# Altium schematic sheet POWER.SchDoc: Animated Archer Main PCB
size Letter; Author: John Eric Martin; Engineer: John Eric Martin; Organization: UCCS IEEE Robotics; Address1: 1420 Austin Bluffs Pkwy; Address2: Colorado Springs, CO 80918; DocumentNumber: POWER; Revision: 1; SheetNumber: 7; SheetTotal: 8; ProjectName: Animated Archer Quadcopter
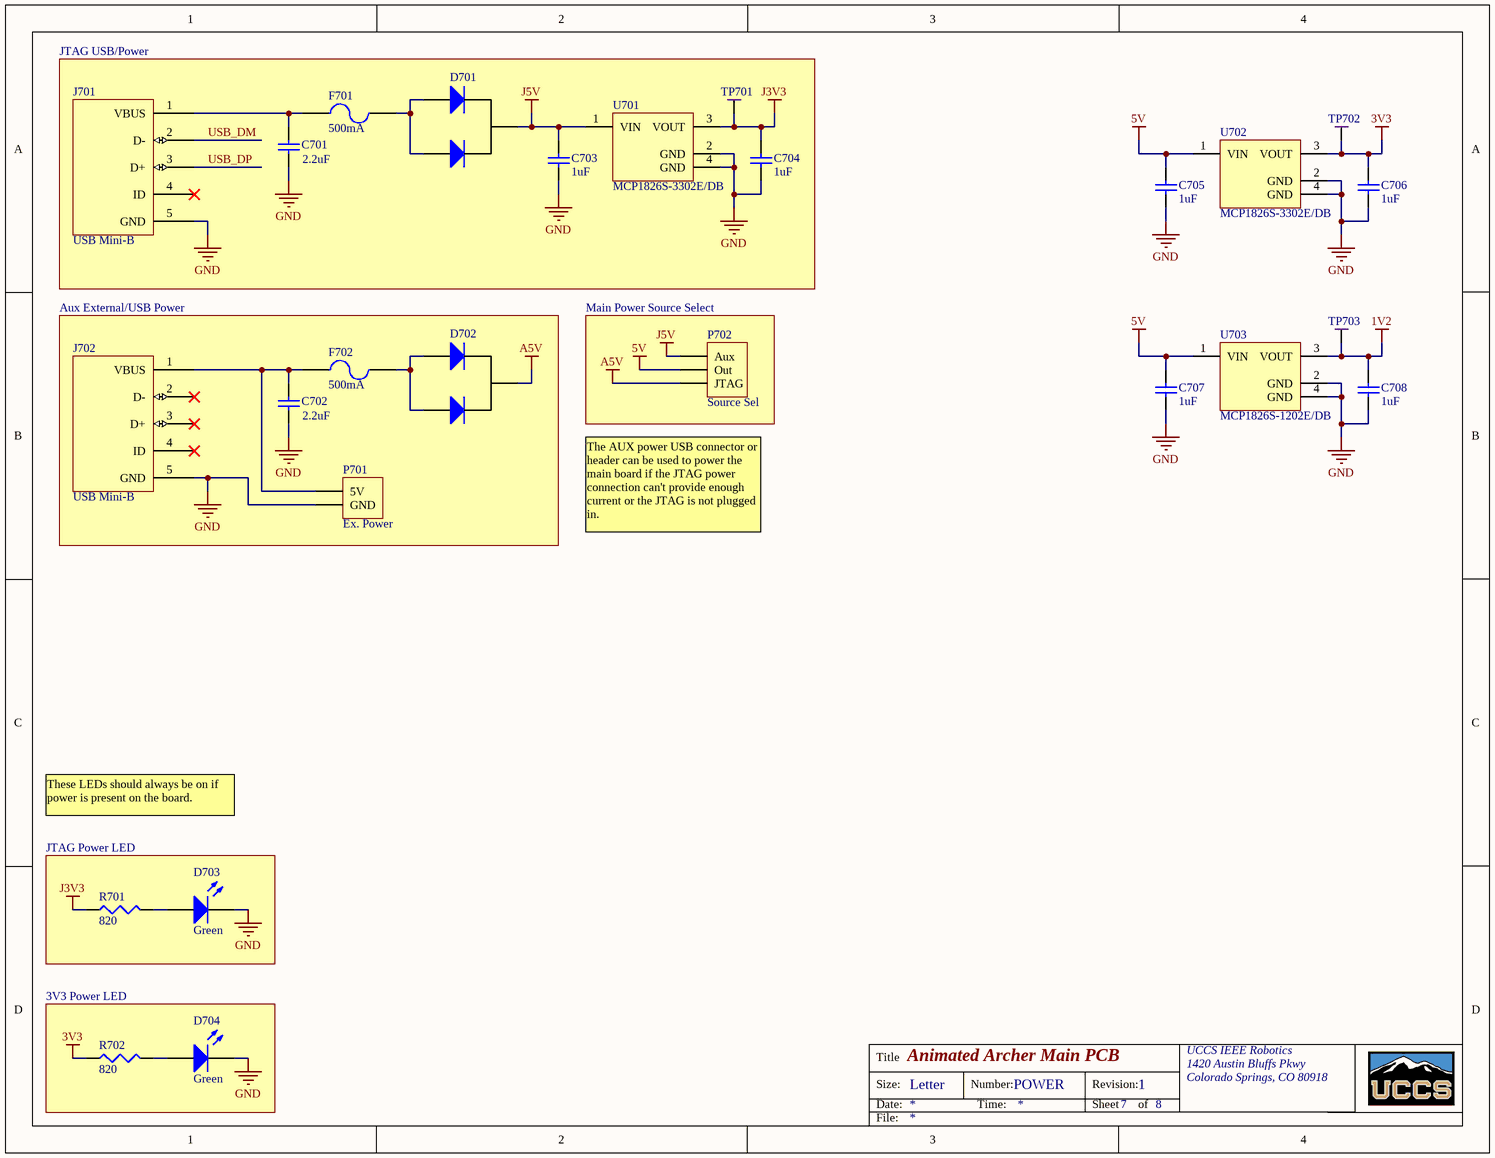
[diagram p0: POWER.SchDoc]

## Parts
C701  value 2.2uF  [1608[0603]]  (hidden comment: Cap Semi)
C702  value 2.2uF  [1608[0603]]  (hidden comment: Cap Semi)
C703  value 1uF  [1608[0603]]  (hidden comment: 0.1uF)
C704  value 1uF  [1608[0603]]  (hidden comment: 0.1uF)
C705  value 1uF  [1608[0603]]  (hidden comment: 0.1uF)
C706  value 1uF  [1608[0603]]  (hidden comment: 0.1uF)
C707  value 1uF  [1608[0603]]  (hidden comment: 0.1uF)
C708  value 1uF  [1608[0603]]  (hidden comment: 0.1uF)
D701  HSMS-2804-BLKG  [SOT-23_N]  (value not drawn)
D702  HSMS-2804-BLKG  [SOT-23_N]  (value not drawn)
D703  Green  [1608[0603]]
D704  Green  [1608[0603]]
F701  500mA  [C0805]
F702  500mA  [C0805]
J701  USB Mini-B  [54819-0572]
J702  USB Mini-B  [54819-0572]
P701  Ex. Power  [HDR1X2]
P702  Source Sel  [HDR1X3]
R701  value 820  [J1-0603]  (hidden comment: Res3)
R702  value 820  [J1-0603]  (hidden comment: Res3)
TP701  Test Point  [TESTPT]  (value not drawn)
TP702  Test Point  [TESTPT]  (value not drawn)
TP703  Test Point  [TESTPT]  (value not drawn)
U701  MCP1826S-3302E/DB  [SOT-223-DB3_N]
U702  MCP1826S-3302E/DB  [SOT-223-DB3_N]
U703  MCP1826S-1202E/DB  [SOT-223-DB3_N]

## Blocks framed on the sheet
JTAG USB/Power: C701 C703 C704 D701 F701 J701 TP701 U701
Aux External/USB Power: C702 D702 F702 J702 P701
Main Power Source Select: P702
JTAG Power LED: D703 R701
3V3 Power LED: D704 R702

## Nets
1V2: C708.2 TP703.1 U703.3(VOUT)
3V3: C706.2 R702.1 TP702.1 U702.3(VOUT)
5V: C705.2 C707.2 P702.2(Out) U702.1(VIN) U703.1(VIN)
A5V: D702.3(K) P702.3(JTAG)
GND: C701.2 C702.2 C703.1 C704.1 C705.1 C706.1 C707.1 C708.1 D703.2(K) D704.2(K) J701.5(GND) J702.5(GND) P701.2(GND) U701.2(GND) U701.4(GND) U702.2(GND) U702.4(GND) U703.2(GND) U703.4(GND)
J3V3: C704.2 R701.1 TP701.1 U701.3(VOUT)
J5V: C703.2 D701.3(K) P702.1(Aux) U701.1(VIN)
USB_DM: J701.2(D-)
USB_DP: J701.3(D+)
NetC701_1: C701.1 F701.2 J701.1(VBUS)
NetC702_1: C702.1 F702.2 J702.1(VBUS) P701.1(5V)
NetD701_1: D701.1(A) D701.2(B) F701.1
NetD702_1: D702.1(A) D702.2(B) F702.1
NetD703_1: D703.1(A) R701.2
NetD704_1: D704.1(A) R702.2

Not connected (* = marked no-connect by the designer): J701 4(ID)* 6(CASE); J702 2(D-)* 3(D+)* 4(ID)* 6(CASE)

## Notes on the sheet
- The AUX power USB connector or header can be used to power the main board if the JTAG power connection can't provide enough current or the JTAG is not plugged in.
- These LEDs should always be on if power is present on the board.
- Title
- Size:
- Date:
- Letter
- Number:
- Time:
- Revision:
- Sheet
- of
- File:

## Library data of the parts
C701-C708 = Cap Semi: Capacitor (Semiconductor SIM Model); Published: 8-Jun-2000; LatestRevisionDate: 29-May-2009; LatestRevisionNote: IPC-7351 Footprint Added.; PackageReference: C1206; Publisher: Altium Limited; PackageDescription: Chip Capacitor
D701 D702 = HSMS-2804-BLKG: Dual Common Cathode Schottky Diode; Note: Pin 2 is not connected and not drawn.; Published: 21-Mar-2003; LatestRevisionDate: 29-May-2009; LatestRevisionNote: IPC-7351 Footprint Added.; DatasheetVersion: Oct-1999; PackageVersion: Sep-2001; PackageReference: SOT-23; Publisher: Altium Limited; PackageDescription: 3-Pin SOT-23 Package 0.95 mm Pitch, 2.5 mm Lead Span; ComponentLink1Description: Manufacturer Link; ComponentLink1URL: http://www.infineon.com/
D703 D704 = LED2: Typical RED, GREEN, YELLOW, AMBER GaAs LED; Published: 8-Jun-2000; LatestRevisionDate: 17-Jul-2002; LatestRevisionNote: Re-released for DXP Platform.; PackageVersion: Feb-2002; PackageReference: 3.2X1.6X1.1; Publisher: Altium Limited; PackageDescription: SM LED; 2 Flat Leads
F701 F702 = Fuse 2: PTC Resettable Fuse; Published: 8-Jun-2000; LatestRevisionDate: 17-Jul-2002; LatestRevisionNote: Re-released for DXP Platform.; PackageReference: PIN-W2/E2.8; Publisher: Altium Limited; PackageDescription: Thru-Hole; 2 Leads
J701 J702 = USB Mini-B: 54819-0572
P701 = Header 2: Header, 2-Pin; LatestRevisionDate: 17-Jul-2002; LatestRevisionNote: Re-released for DXP Platform.; Publisher: Altium Limited
P702 = Header 3: Header, 3-Pin; LatestRevisionDate: 17-Jul-2002; LatestRevisionNote: Re-released for DXP Platform.; Publisher: Altium Limited
R701 R702 = Res3: Resistor; Published: 8-Jun-2000; LatestRevisionDate: 29-May-2009; LatestRevisionNote: IPC-7351 Footprint Added.; PackageReference: J1-0603; Publisher: Altium Limited; PackageDescription: Chip Resistor
U701 U702 = MCP1826S-3302E/DB: 1000 mA, Low Voltage, Low Quiescent Current LDO Regulator, 3-Pin SOT-223, Extended Temperature; Published: 29-Jan-2009; DatasheetVersion: revA, Aug-2007; PackageVersion: revBB, Aug-2009; PackageReference: SOT-223-DB3; Publisher: Altium Limited; PackageDescription: 3-Lead Plastic Small Outline Transistor (DB) [SOT-223]; Supplier 1: Digi-Key; Supplier Part Number 1: MCP1826S-3302E/DB-ND; Supplier 2: Farnell; Supplier Part Number 2: 1578424; ComponentLink1Description: Datasheet; ComponentLink1URL: http://ww1.microchip.com/downloads/en/DeviceDoc/22057a.pdf; ComponentLink2Description: Packaging Specification; ComponentLink2URL: http://www.microchip.com/stellent/groups/techpub_sg/documents/packagingspec/en012702.pdf; ComponentLink3Description: Microchip.com Home; ComponentLink3URL: http://www.microchip.com/
U703 = MCP1826S-1202E/DB: 1000 mA, Low Voltage, Low Quiescent Current LDO Regulator, 3-Pin SOT-223, Extended Temperature; Published: 29-Jan-2009; DatasheetVersion: revA, Aug-2007; PackageVersion: revBB, Aug-2009; PackageReference: SOT-223-DB3; Publisher: Altium Limited; PackageDescription: 3-Lead Plastic Small Outline Transistor (DB) [SOT-223]; Supplier 1: Digi-Key; Supplier Part Number 1: MCP1826S-1202E/DB-ND; ComponentLink1Description: Datasheet; ComponentLink1URL: http://ww1.microchip.com/downloads/en/DeviceDoc/22057a.pdf; ComponentLink2Description: Packaging Specification; ComponentLink2URL: http://www.microchip.com/stellent/groups/techpub_sg/documents/packagingspec/en012702.pdf; ComponentLink3Description: Microchip.com Home; ComponentLink3URL: http://www.microchip.com/